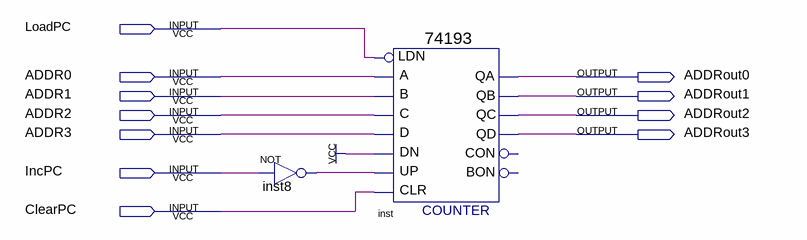
[diagram p0: schematic sheet]
// Quartus schematic ProgramCounter.bdf as structural Verilog: 2 symbols, 11 pins
module ProgramCounter (
  input  LoadPC,
  input  ADDR0,
  input  ADDR1,
  input  ADDR2,
  input  ADDR3,
  input  IncPC,
  input  ClearPC,
  output ADDRout0,
  output ADDRout1,
  output ADDRout2,
  output ADDRout3
);

  wire inst8_out;

  not inst8 (inst8_out, IncPC);
  \74193  inst (
    .D(ADDR3), .C(ADDR2), .B(ADDR1), .A(ADDR0), .CLR(ClearPC), .UP(inst8_out), .DN(1'b1), .LDN(LoadPC),
    .QB(ADDRout1), .QA(ADDRout0), .QD(ADDRout3), .QC(ADDRout2));  // open: CON, BON
endmodule
